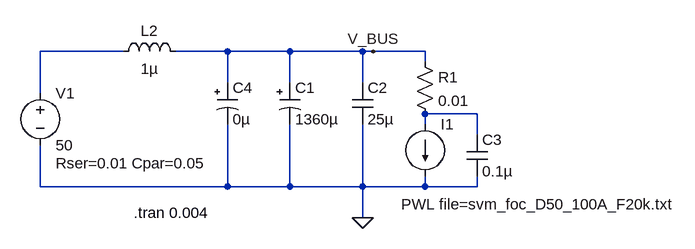
[diagram p0: schematic sim_caps_foc.asc]
sim_caps_foc.asc, the LTspice schematic file:
Version 4
SHEET 1 1212 680
WIRE 16 256 -112 256
WIRE 176 256 96 256
WIRE 272 256 176 256
WIRE 384 256 272 256
WIRE 400 256 384 256
WIRE 480 256 400 256
WIRE 480 272 480 256
WIRE 176 304 176 256
WIRE 272 304 272 256
WIRE 384 304 384 256
WIRE -112 320 -112 256
WIRE 560 352 480 352
WIRE 480 368 480 352
WIRE 560 384 560 352
WIRE -112 464 -112 400
WIRE 176 464 176 368
WIRE 176 464 -112 464
WIRE 272 464 272 368
WIRE 272 464 176 464
WIRE 384 464 384 368
WIRE 384 464 272 464
WIRE 480 464 480 448
WIRE 480 464 384 464
WIRE 560 464 560 448
WIRE 560 464 480 464
WIRE 384 512 384 464
FLAG 384 512 0
FLAG 400 256 V_BUS
SYMBOL ind 0 272 R270
WINDOW 0 32 56 VTop 2
WINDOW 3 5 56 VBottom 2
SYMATTR InstName L2
SYMATTR Value 1µ
SYMATTR SpiceLine Rser=0.01
SYMBOL polcap 256 304 R0
WINDOW 3 24 56 Left 2
SYMATTR Value 1360µ
SYMATTR InstName C1
SYMATTR Description Capacitor
SYMATTR Type cap
SYMATTR SpiceLine V=100 Irms=0 Rser=0.01 Lser=0.01u
SYMBOL voltage -112 304 R0
WINDOW 123 0 0 Left 2
WINDOW 39 24 124 Left 2
SYMATTR SpiceLine Rser=0.01 Cpar=0.05
SYMATTR InstName V1
SYMATTR Value 50
SYMBOL current 480 368 R0
WINDOW 123 0 0 Left 2
WINDOW 39 0 0 Left 2
WINDOW 3 -37 123 Left 2
SYMATTR Value PWL file=svm_foc_D50_100A_F20k.txt
SYMATTR InstName I1
SYMBOL cap 368 304 R0
SYMATTR InstName C2
SYMATTR Value 25µ
SYMATTR SpiceLine V=85 Rser=0.0002 Lser=0.001u
SYMBOL res 464 256 R0
SYMATTR InstName R1
SYMATTR Value 0.01
SYMBOL cap 544 384 R0
SYMATTR InstName C3
SYMATTR Value 0.1µ
SYMBOL polcap 160 304 R0
WINDOW 3 24 56 Left 2
SYMATTR Value 0µ
SYMATTR InstName C4
SYMATTR Description Capacitor
SYMATTR Type cap
SYMATTR SpiceLine V=100 Irms=0 Rser=0.002 Lser=0.01u
TEXT 32 504 Left 2 !.tran 0.004

The netlist it stands for:
* sim_caps_foc.asc
L2 N001 V_BUS 1µ Rser=0.01
C1 V_BUS 0 1360µ V=100 Irms=0 Rser=0.01 Lser=0.01u
V1 N001 0 50 Rser=0.01 Cpar=0.05
I1 N002 0 PWL file=svm_foc_D50_100A_F20k.txt
C2 V_BUS 0 25µ V=85 Rser=0.0002 Lser=0.001u
R1 V_BUS N002 0.01
C3 N002 0 0.1µ
C4 V_BUS 0 0µ V=100 Irms=0 Rser=0.002 Lser=0.01u
.tran 0.004
.backanno
.end